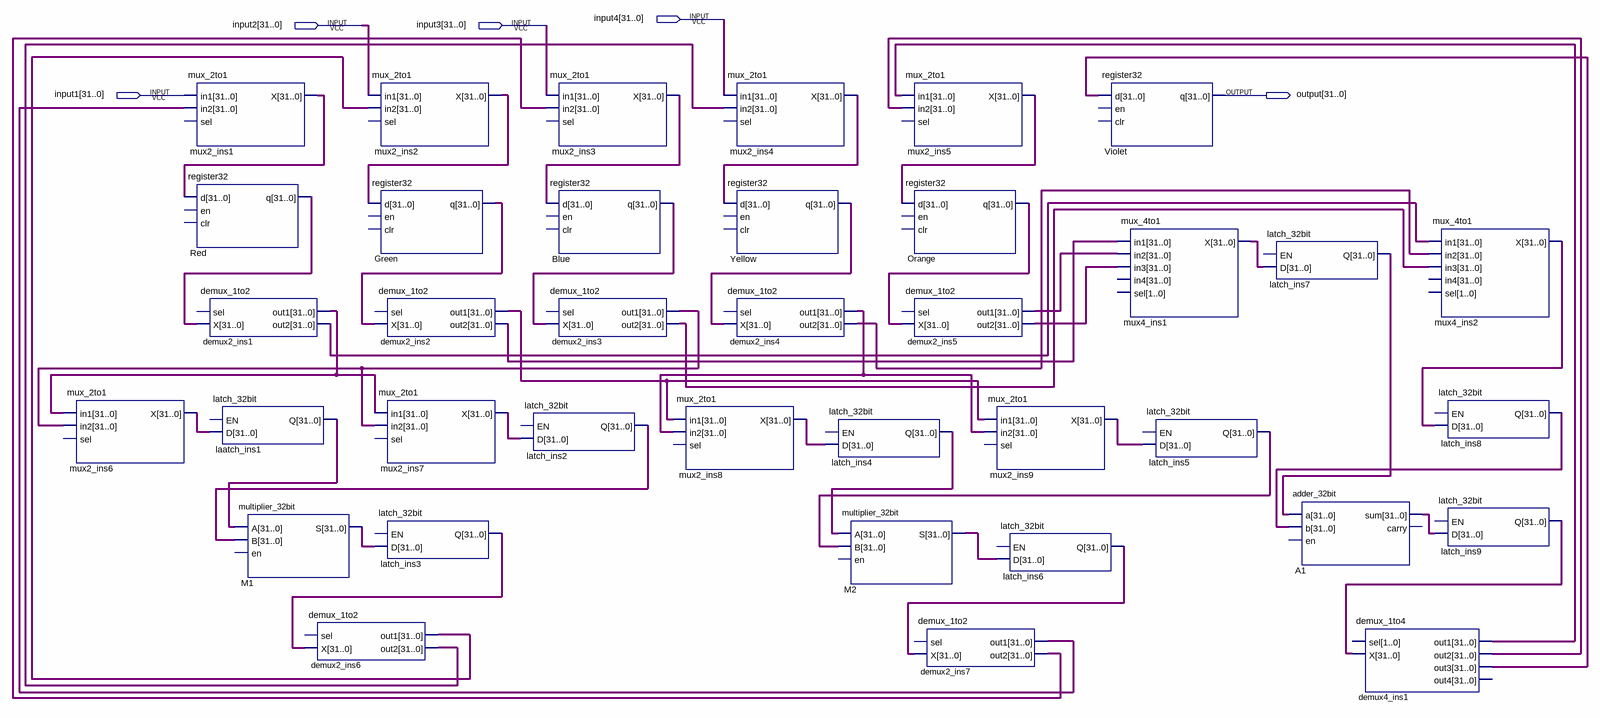
[diagram p0: schematic sheet]
// Quartus schematic palmprint_PSO.bdf as structural Verilog: 37 symbols, 5 pins
module palmprint_PSO (
  input  [31:0] input4,
  input  [31:0] input2,
  input  [31:0] input3,
  input  [31:0] input1,
  output [31:0] \output 
);

  wire [31:0] A1_sum, Blue_q, demux2_ins1_out1, demux2_ins1_out2, demux2_ins2_out1, demux2_ins2_out2,
       demux2_ins3_out1, demux2_ins3_out2, demux2_ins4_out1, demux2_ins4_out2, demux2_ins5_out1,
       demux2_ins5_out2, demux2_ins6_out1, demux2_ins6_out2, demux2_ins7_out1, demux2_ins7_out2,
       demux4_ins1_out1, demux4_ins1_out2, demux4_ins1_out3, Green_q, laatch_ins1_q, latch_ins2_q,
       latch_ins3_q, latch_ins4_q, latch_ins5_q, latch_ins6_q, latch_ins7_q, latch_ins8_q, latch_ins9_q,
       M1_s, M2_s, mux2_ins1_x, mux2_ins2_x, mux2_ins3_x, mux2_ins4_x, mux2_ins5_x, mux2_ins6_x, mux2_ins7_x,
       mux2_ins8_x, mux2_ins9_x, mux4_ins1_x, mux4_ins2_x, Orange_q, Red_q, Yellow_q;

  mux_2to1 mux2_ins6 (.in1(demux2_ins1_out1), .in2(demux2_ins3_out1), .X(mux2_ins6_x));  // open: sel
  mux_2to1 mux2_ins1 (.in1(input1), .in2(demux2_ins7_out1), .X(mux2_ins1_x));  // open: sel
  register32 Red (.d(mux2_ins1_x), .q(Red_q));  // open: en, clr
  demux_1to2 demux2_ins1 (.X(Red_q), .out1(demux2_ins1_out1), .out2(demux2_ins1_out2));  // open: sel
  latch_32bit laatch_ins1 (.D(mux2_ins6_x), .Q(laatch_ins1_q));  // open: EN
  multiplier_32bit M1 (.A(laatch_ins1_q), .B(latch_ins2_q), .S(M1_s));  // open: en
  demux_1to2 demux2_ins6 (.X(latch_ins3_q), .out1(demux2_ins6_out1), .out2(demux2_ins6_out2));  // open: sel
  mux_2to1 mux2_ins2 (.in1(input2), .in2(demux2_ins6_out1), .X(mux2_ins2_x));  // open: sel
  register32 Green (.d(mux2_ins2_x), .q(Green_q));  // open: en, clr
  demux_1to2 demux2_ins2 (.X(Green_q), .out1(demux2_ins2_out1), .out2(demux2_ins2_out2));  // open: sel
  mux_2to1 mux2_ins7 (.in1(demux2_ins1_out1), .in2(demux2_ins3_out1), .X(mux2_ins7_x));  // open: sel
  latch_32bit latch_ins3 (.D(M1_s), .Q(latch_ins3_q));  // open: EN
  mux_2to1 mux2_ins3 (.in1(input3), .in2(demux2_ins7_out2), .X(mux2_ins3_x));  // open: sel
  register32 Blue (.d(mux2_ins3_x), .q(Blue_q));  // open: en, clr
  demux_1to2 demux2_ins3 (.X(Blue_q), .out1(demux2_ins3_out1), .out2(demux2_ins3_out2));  // open: sel
  latch_32bit latch_ins2 (.D(mux2_ins7_x), .Q(latch_ins2_q));  // open: EN
  mux_2to1 mux2_ins8 (.in1(demux2_ins2_out1), .in2(demux2_ins4_out1), .X(mux2_ins8_x));  // open: sel
  mux_2to1 mux2_ins4 (.in1(input4), .in2(demux2_ins6_out2), .X(mux2_ins4_x));  // open: sel
  register32 Yellow (.d(mux2_ins4_x), .q(Yellow_q));  // open: en, clr
  demux_1to2 demux2_ins4 (.X(Yellow_q), .out1(demux2_ins4_out1), .out2(demux2_ins4_out2));  // open: sel
  latch_32bit latch_ins4 (.D(mux2_ins8_x), .Q(latch_ins4_q));  // open: EN
  multiplier_32bit M2 (.A(latch_ins4_q), .B(latch_ins5_q), .S(M2_s));  // open: en
  mux_2to1 mux2_ins5 (.in1(demux4_ins1_out1), .in2(demux4_ins1_out2), .X(mux2_ins5_x));  // open: sel
  register32 Orange (.d(mux2_ins5_x), .q(Orange_q));  // open: en, clr
  demux_1to2 demux2_ins5 (.X(Orange_q), .out1(demux2_ins5_out1), .out2(demux2_ins5_out2));  // open: sel
  demux_1to2 demux2_ins7 (.X(latch_ins6_q), .out1(demux2_ins7_out1), .out2(demux2_ins7_out2));  // open: sel
  mux_2to1 mux2_ins9 (.in1(demux2_ins2_out1), .in2(demux2_ins4_out1), .X(mux2_ins9_x));  // open: sel
  latch_32bit latch_ins6 (.D(M2_s), .Q(latch_ins6_q));  // open: EN
  register32 Violet (.d(demux4_ins1_out3), .q(\output ));  // open: en, clr
  mux_4to1 mux4_ins1 (
    .in1(demux2_ins2_out2), .in2(demux2_ins5_out1), .in3(demux2_ins5_out2), .X(mux4_ins1_x));  // open: in4, sel
  latch_32bit latch_ins5 (.D(mux2_ins9_x), .Q(latch_ins5_q));  // open: EN
  latch_32bit latch_ins7 (.D(mux4_ins1_x), .Q(latch_ins7_q));  // open: EN
  adder_32bit A1 (.a(latch_ins7_q), .b(latch_ins8_q), .sum(A1_sum));  // open: en, carry
  demux_1to4 demux4_ins1 (
    .X(latch_ins9_q), .out1(demux4_ins1_out1), .out2(demux4_ins1_out2), .out3(demux4_ins1_out3));  // open: sel, out4
  mux_4to1 mux4_ins2 (
    .in1(demux2_ins1_out2), .in2(demux2_ins4_out2), .in3(demux2_ins3_out2), .X(mux4_ins2_x));  // open: in4, sel
  latch_32bit latch_ins8 (.D(mux4_ins2_x), .Q(latch_ins8_q));  // open: EN
  latch_32bit latch_ins9 (.D(A1_sum), .Q(latch_ins9_q));  // open: EN
endmodule
